# Altium schematic sheet 电源部分.SchDoc
size A2
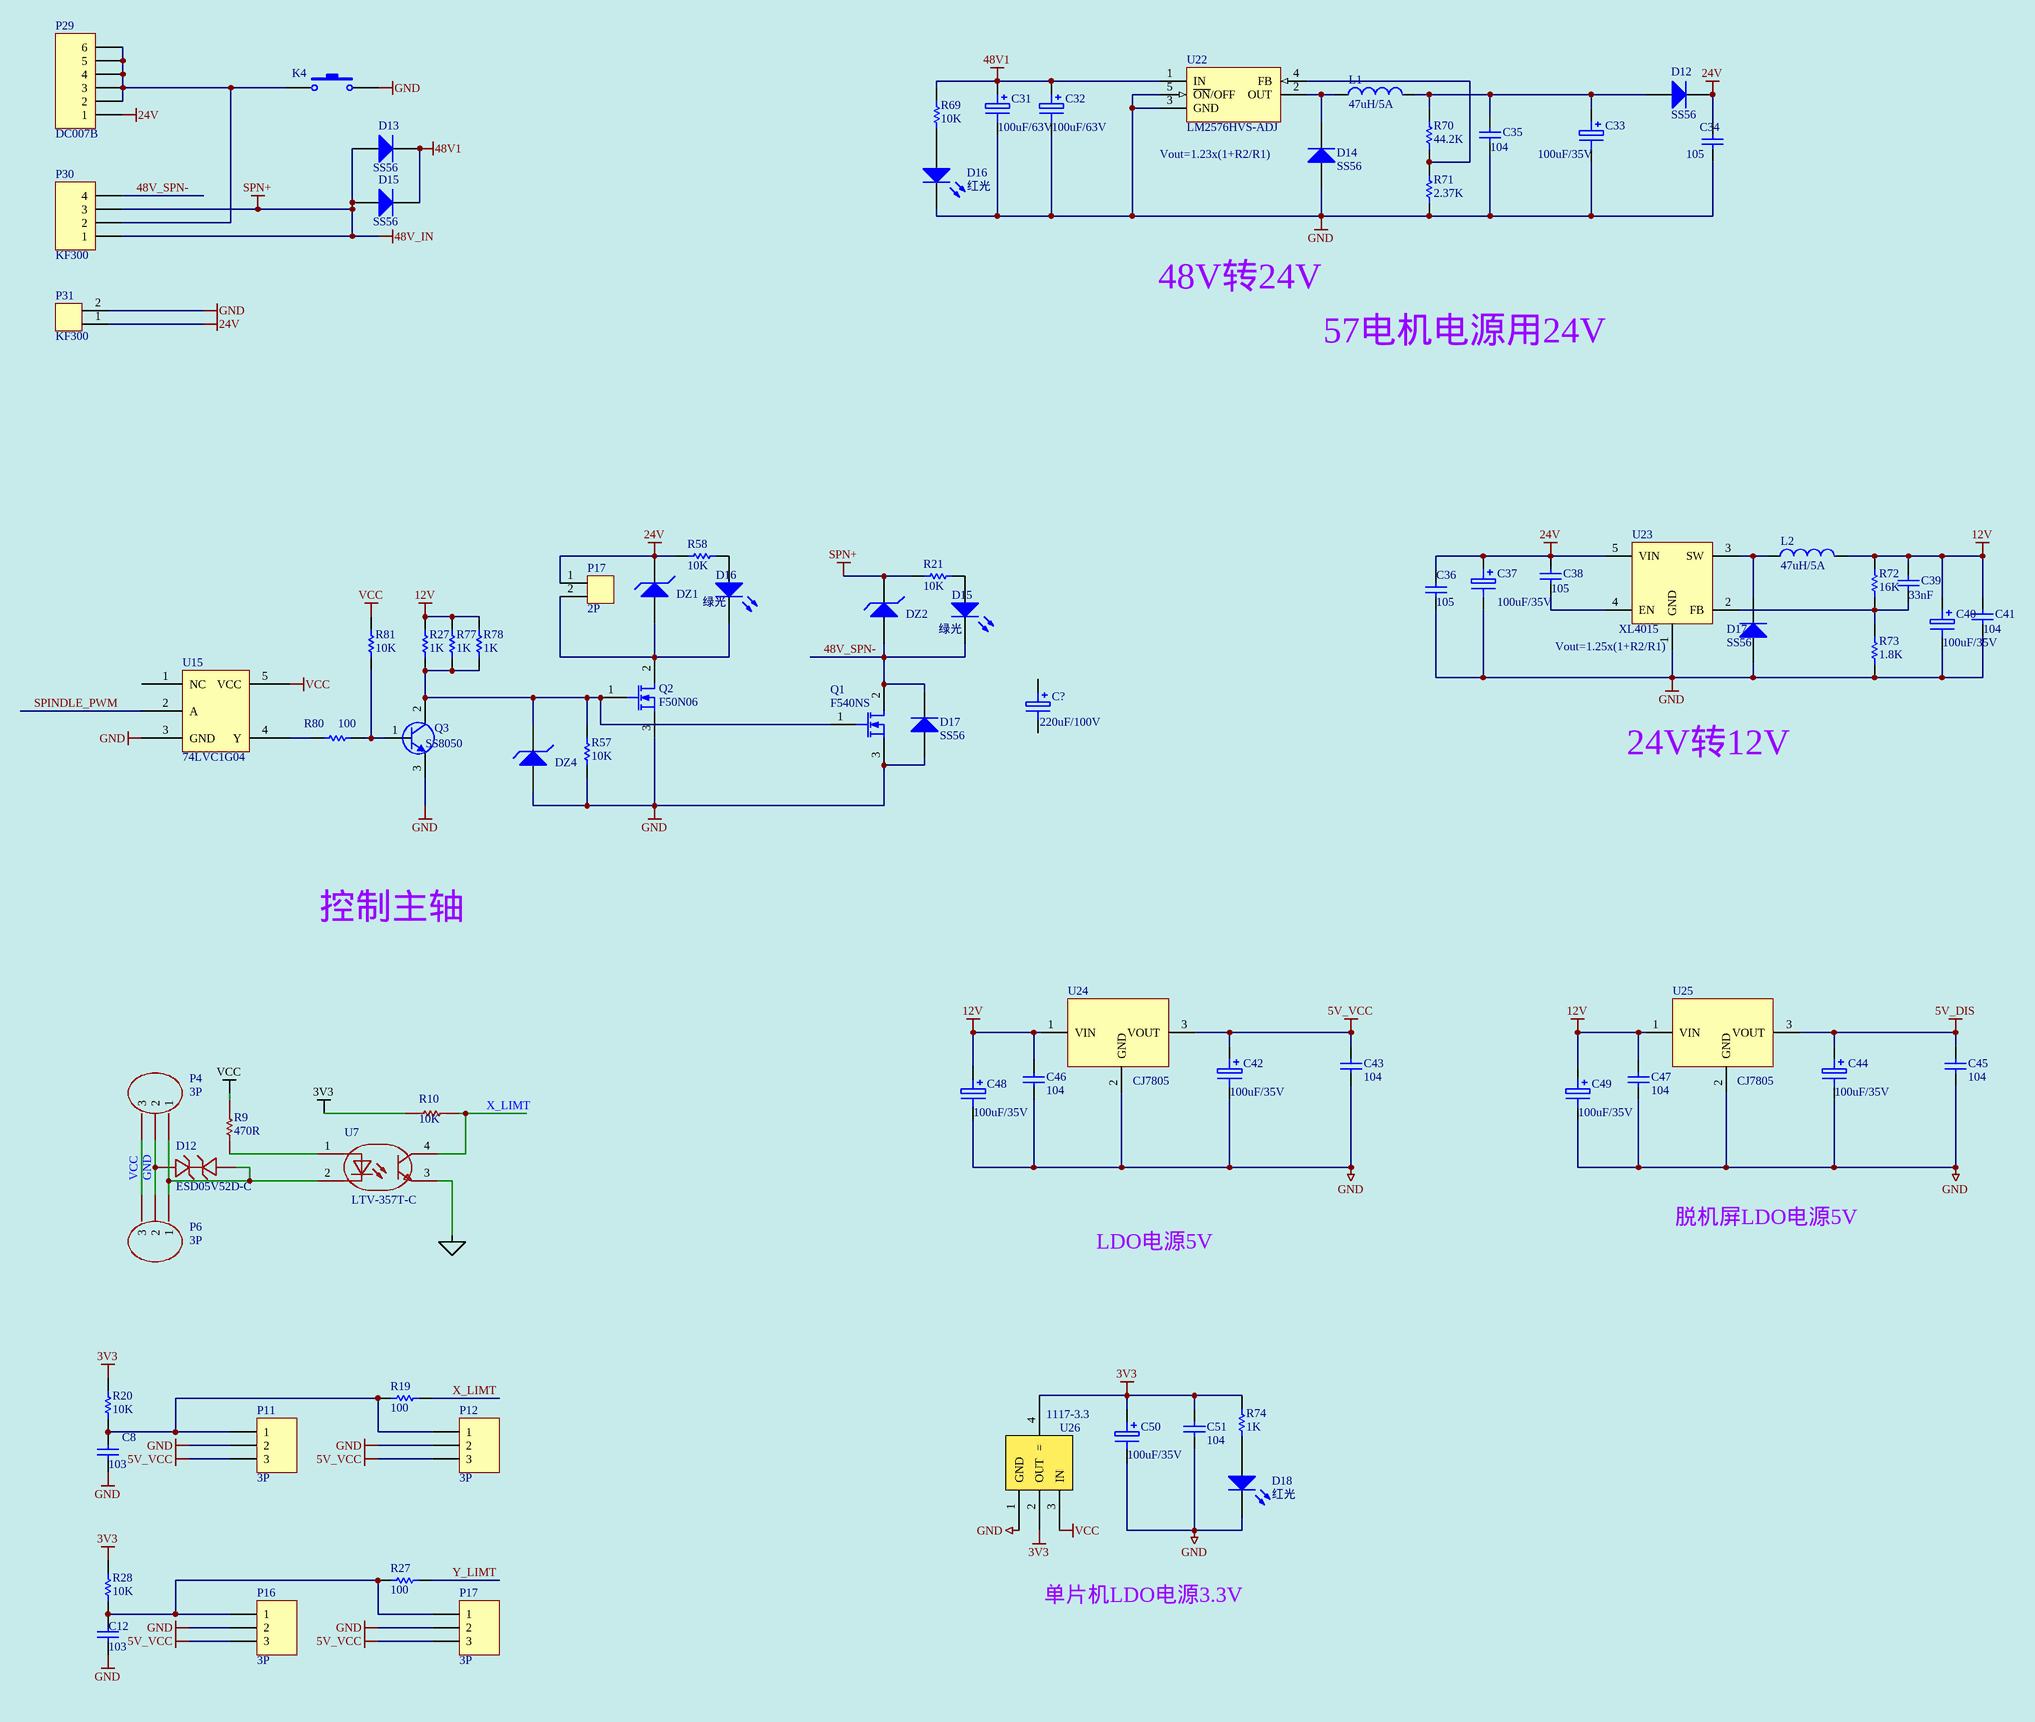
[diagram p0: 电源部分.SchDoc]

## Parts
(Parts that share a designator on the sheet are numbered #1, #2 ... from top to bottom, then left to right.)
C8  103  [0603C]
C12  103  [0603C]
C31  100uF/63V  [电解电容贴片10x10]
C32  100uF/63V  [电解电容贴片10x10]
C33  100uF/35V  [电解电容贴片6x6]
C34  105  [0805C]
C35  104  [0603C]
C36  105  [0805C]
C37  100uF/35V  [电解电容贴片6x6]
C38  105  [0805C]
C39  33nF  [0603C]
C40  100uF/35V  [电解电容贴片6x6]
C41  104  [0603C]
C42  100uF/35V  [电解电容贴片6x6]
C43  104  [0603C]
C44  100uF/35V  [电解电容贴片6x6]
C45  104  [0603C]
C46  104  [0603C]
C47  104  [0603C]
C48  100uF/35V  [电解电容贴片6x6]
C49  100uF/35V  [电解电容贴片6x6]
C50  100uF/35V  [电解电容贴片6x6]
C51  104  [0603C]
C?  220uF/100V  [电解电容贴片6x6]
D12#1  SS56  [SMA]
D12#2  ESD05V52D-C  [SOD-523_L1.2-W0.8-LS1.6-BI]
D13  SS56  [SMA]
D14  SS56  [SMA]
D15#1  SS56  [SMA]
D15#2  绿光  [0603LED]
D16#1  红光  [0603LED]
D16#2  绿光  [0603LED]
D17#1  SS56  [SMA]
D17#2  SS56  [SMA]
D18  红光  [0603LED]
DZ1  快恢复二极管RS2M  [SMC]  (value not drawn)
DZ2  快恢复二极管RS2M  [SMC]  (value not drawn)
DZ4  稳压二极管SMAZ10V  [SMA]  (value not drawn)
K4  开关按键  [船型开关KCD1-101]  (value not drawn)
L1  47uH/5A  [电感贴片12x12]
L2  47uH/5A  [电感贴片12x12]
P4  3P  [HDR1X3_CON]
P6  3P  [HDR1X3_CON]
P11  3P  [HDR1X3_CON]
P12  3P  [HDR1X3_CON]
P16  3P  [HDR1X3_CON]
P17#1  2P  [VH3.96-2P直插座]
P17#2  3P  [HDR1X3_CON]
P29  DC007B  [DC007B]
P30  KF300  [直插座4P-KF300]
P31  KF300  [直插座2P-KF300]
Q1  F540NS  [TO-263-2]
Q2  F50N06  [TO-252]
Q3  SS8050  [SOT-23]
R9  470R  [0603R]
R10  10K  [0603R]
R19  100  [0603R]
R20  10K  [0603R]
R21  10K  [0603R]
R27#1  1K  [0603R]
R27#2  100  [0603R]
R28  10K  [0603R]
R57  10K  [0603R]
R58  10K  [0603R]
R69  10K  [0603R]
R70  44.2K  [0603R]
R71  2.37K  [0603R]
R72  16K  [0603R]
R73  1.8K  [0603R]
R74  1K  [0603R]
R77  1K  [0603R]
R78  1K  [0603R]
R80  100  [0603R]
R81  10K  [0603R]
U7  LTV-357T-C  [SOP-4_L4.4-W3.9-P2.54-LS7.0-TL]
U15  74LVC1G04  [SOT-23-5]
U22  LM2576HVS-ADJ  [TO-263]
U23  XL4015  [TO-263]
U24  CJ7805  [TO-263-2]
U25  CJ7805  [TO-263-2]
U26  1117-3.3  [SOT-223]

## Nets
3V3: C50.1 C51.2 R10.2 R20.2 R28.2 R74.1 U26.2(OUT) U26.4(=)
5V_DIS: C44.1 C45.2 U25.3(VOUT)
5V_VCC: C42.1 C43.2 P11.3 P12.3 P16.3 P17#2.3 U24.3(VOUT)
12V: C39.2 C40.1 C41.2 C46.2 C47.2 C48.1 C49.1 L2.2 R27#1.2 R72.2 R77.2 R78.2 U24.1(VIN) U25.1(VIN)
24V: C34.1 C36.1 C37.1 C38.2 D12#1.2 DZ1.2 P17#1.1 P29.1 P31.1 R58.1 U23.5(VIN)
48V1: C31.1 C32.1 D13.2 D15#1.2 R69.2 U22.1(IN)
48V_IN: D13.1 D15#1.1 DZ2.2 P30.1 P30.3 R21.1  [also labelled SPN+]
GND: C8.1 C12.1 C31.2 C32.2 C33.2 C34.2 C35.1 C36.2 C37.2 C40.2 C41.1 C42.2 C43.1 C44.2 C45.1 C46.1 C47.1 C48.2 C49.2 C50.2 C51.1 D12#2.1 D14.1 D16#1.2 D17#1.1 D17#2.1 D18.2 DZ4.1 K4.2 P4.2 P6.2 P11.2 P12.2 P16.2 P17#2.2 P31.2 Q1.3(S) Q2.3(S) Q3.3(E) R57.2 R71.1 R73.1 U15.3(GND) U22.3(GND) U22.5(~{ON}/OFF) U23.1(GND) U24.2(GND) U25.2(GND) U26.1(GND)
PGND: U7.3
VCC: P4.3 P6.3 R9.2 R81.2 U15.5(VCC) U26.3(IN)
48V_SPN-: D15#2.2 D17#2.2 DZ2.1 P30.4 Q1.2(D)
SPINDLE_PWM: U15.2(A)
X_LIMT: R10.1 R19.1 U7.4
Y_LIMT: R27#2.1
NetC8_2: C8.2 P11.1 P12.1 R19.2 R20.1
NetC12_2: C12.2 P16.1 P17#2.1 R27#2.2 R28.1
NetC33_1: C33.1 C35.2 D12#1.1 L1.2 R70.2
NetC38_1: C38.1 U23.4(EN)
NetC39_1: C39.1 R72.1 R73.2 U23.2(FB)
NetD12#2_2: D12#2.2 P4.1 P6.1 U7.2
NetD14_2: D14.2 L1.1 U22.2(OUT)
NetD15#2_1: D15#2.1 R21.2
NetD16#1_1: D16#1.1 R69.1
NetD16#2_1: D16#2.1 R58.2
NetD16#2_2: D16#2.2 DZ1.1 P17#1.2 Q2.2(D)
NetD17#1_2: D17#1.2 L2.1 U23.3(SW)
NetD18_1: D18.1 R74.2
NetDZ4_2: DZ4.2 Q1.1(G) Q2.1(G) Q3.2(C) R27#1.1 R57.1 R77.1 R78.1
NetK4_1: K4.1 P29.2 P29.3 P29.4 P29.5 P29.6 P30.2
NetQ3_1: Q3.1(B) R80.2 R81.1
NetR9_1: R9.1 U7.1
NetR70_1: R70.1 R71.2 U22.4(FB)
NetR80_1: R80.1 U15.4(Y)

Not connected (* = marked no-connect by the designer): C? 1 2; U15 1(NC)

## Notes on the sheet
- Vout=1.23x(1+R2/R1)
- 48V转24V
- 57电机电源用24V
- (near U23) Vout=1.25x(1+R2/R1)
- 24V转12V
- 控制主轴
- LDO电源5V
- 脱机屏LDO电源5V
- 单片机LDO电源3.3V

## Library data of the parts
C8 C12 C34-C36 C38 C39 C41 = CAP
C31-C33 C37 C40 C42 C44 C48-C50 C? = ELECTRO1
C43 C45-C47 C51 = Cap Semi: Capacitor (Semiconductor SIM Model); Published: 8-Jun-2000; LatestRevisionDate: 17-Jul-2002; LatestRevisionNote: Re-released for DXP Platform.; PackageReference: C1206; Publisher: Altium Limited; Value: 104
D12#1 D13 D14 D15#1 D17#1 D17#2 = 1N4148
D12#2 = ESD05V52D-C: 极性：双向 反向截止电压(Vrwm)：5V 击穿电压(VBR)：5.6V 钳位电压(Vc)@Ipp：15V 反向截止电压(Vrwm)：5V 击穿电压(最小值)：5.6V 峰值脉冲电流(Ipp)@tp=8/20μs：5A 最大钳位电压：15V; Manufacturer: TWGMC(台湾迪嘉); Add into BOM: yes; Symbol: ESD05V52D-C; Device: ESD05V52D-C; LCSC Part Name: ESD05V52D-C; Supplier Part: C727170; Manufacturer Part: ESD05V52D-C; Supplier Footprint: SOD-523; JLCPCB Part Class: 扩展库; Datasheet: https://atta.szlcsc.com/upload/public/pdf/source/20200827/C727170_700AFDE065FF081A69A0C04747B3686A.pdf; Supplier: LCSC; Convert to PCB: yes; Comment_1: ESD05V52D-C
D15#2 D16#1 D16#2 D18 = LED
DZ1 DZ2 DZ4 = 稳压二极管
K4 = 按键
L1 L2 = Inductor: Code_IEC: 1005; Published: 8-Jun-2000; LatestRevisionDate: 29-May-2009; LatestRevisionNote: IPC-7351 Footprint Added.; PackageReference: 0402-A; Publisher: Altium Limited; PackageDescription: Chip Inductor; Code_JEITA: 0402
P4 P6 = 3P: Add into BOM: yes; Symbol: 3P; Device: 3P; Convert to PCB: yes; Origin Footprint: HDR1X3_CON; Design Item ID: 3P; Library Name: SCH--װ--; Comment_1: 3P
P29 = 6P
P30 = 4P
P31 = 2P
Q1 Q2 = MOSFET-N: N-Channel MOSFET; Published: 8-Jun-2000; LatestRevisionDate: 17-Jul-2002; LatestRevisionNote: Re-released for DXP Platform.; PackageVersion: 1995/1996; PackageReference: E3; Publisher: Altium Limited
Q3 = NPN: Published: 8-Jun-2000; LatestRevisionDate: 17-Jul-2002; LatestRevisionNote: Re-released for DXP Platform.; PackageReference: TO-226; Publisher: Altium Limited; Code_JEDEC: TO-226-AA
R9 = 10K: Resistor; Symbol: RES; Origin Footprint 2: AXIAL-0.3; Origin Footprint 3: R0805; Origin Footprint 4: 0805R; Add into BOM: yes; Device: 10K; Published: 8-Jun-2000; LatestRevisionDate: 17-Jul-2002; LatestRevisionNote: Re-released for DXP Platform.; PackageReference: AXIAL-0.3; Publisher: Altium Limited; Convert to PCB: yes; Origin Footprint 1: 0603R; Design Item ID: RES; Library Name: SCH--װ--; Comment_1: 470R
R10 = 100: Resistor; Symbol: RES; Origin Footprint 2: AXIAL-0.3; Origin Footprint 3: R0805; Origin Footprint 4: 0805R; Add into BOM: yes; Device: 100; Published: 8-Jun-2000; LatestRevisionDate: 17-Jul-2002; LatestRevisionNote: Re-released for DXP Platform.; PackageReference: AXIAL-0.3; Publisher: Altium Limited; Convert to PCB: yes; Origin Footprint 1: 0603R; Design Item ID: RES; Library Name: SCH--װ--; Comment_1: 10K
R19-R21 R27#1 R27#2 R28 R57 R58 R69-R74 R77 R78 R80 R81 = RES: Resistor; Published: 8-Jun-2000; LatestRevisionDate: 17-Jul-2002; LatestRevisionNote: Re-released for DXP Platform.; PackageReference: AXIAL-0.3; Publisher: Altium Limited
U7 = LTV-357T-C: 输入电压类型:DC;正向电压:1.2V;输出电流:50mA;隔离电压(rms):3.75kV;反向电压:6V;接收端电压:35V;输出通道数:1;集射极饱和电压(Vce(sat)@Ic,IF):200mV@1mA,20mA;; Manufacturer: LITEON(光宝); Symbol: LTV-357T-C_C119091; Add into BOM: yes; Input voltage type: DC; Output Type: 光电三极管; Forward Voltage: 1.2V; Output Current: 50mA; Isolation Voltage(rms): 3.75kV; Reverse Voltage: 6V; Receiving End Voltage: 35V; Number of Outputs: 1; Rise time: 4us@2mA,100Ω; Fall time: 3us@2mA,100Ω; Device: LTV-357T-C; Supplier: LCSC; Manufacturer Part: LTV-357T-C; Supplier Part: C119091; JLCPCB Part Class: 扩展库; LCSC Part Name: DC输入隔离电压(rms):3750V; Supplier Footprint: SOP-4-2.54mm; Datasheet: https://atta.szlcsc.com/upload/public/pdf/source/20170930/C133128_1506736380934997376.pdf; Convert to PCB: yes; Collector-Emitter Saturation Voltage (Vce(sat)@Ic,IF): 200mV@1mA,20mA; Operating Temperature: -55℃~+110℃; Comment_1: LTV-357T-C
U15 = 74LVC1G17
U22 = LM2576S-5.0: Simple Switcher 3A Step Down Voltage Regulator; Note: Tab is connected to GND; Published: 15-Apr-2002; DatasheetVersion: Jun-1999; PackageReference: TS5B; Publisher: Altium Limited; PackageDescription: D2-PAK; 5 Leads; Body 14.4 (inc. leads) x 10.4 mm (LxW max); ComponentLink1Description: Manufacturer Link; ComponentLink1URL: http://www.national.com/; ComponentLink2Description: Datasheet; ComponentLink2URL: http://www.national.com/ds.cgi/LM/LM2576.pdf; ComponentLink3Description: URL Link1; ComponentLink3URL: http://www.national.com/pf/LM/LM2576.html
U23 = XL4005
U24 U25 = 7805
U26 = LM1117